# Altium schematic sheet Sheet_2.schdoc
size 424 x 302 mm
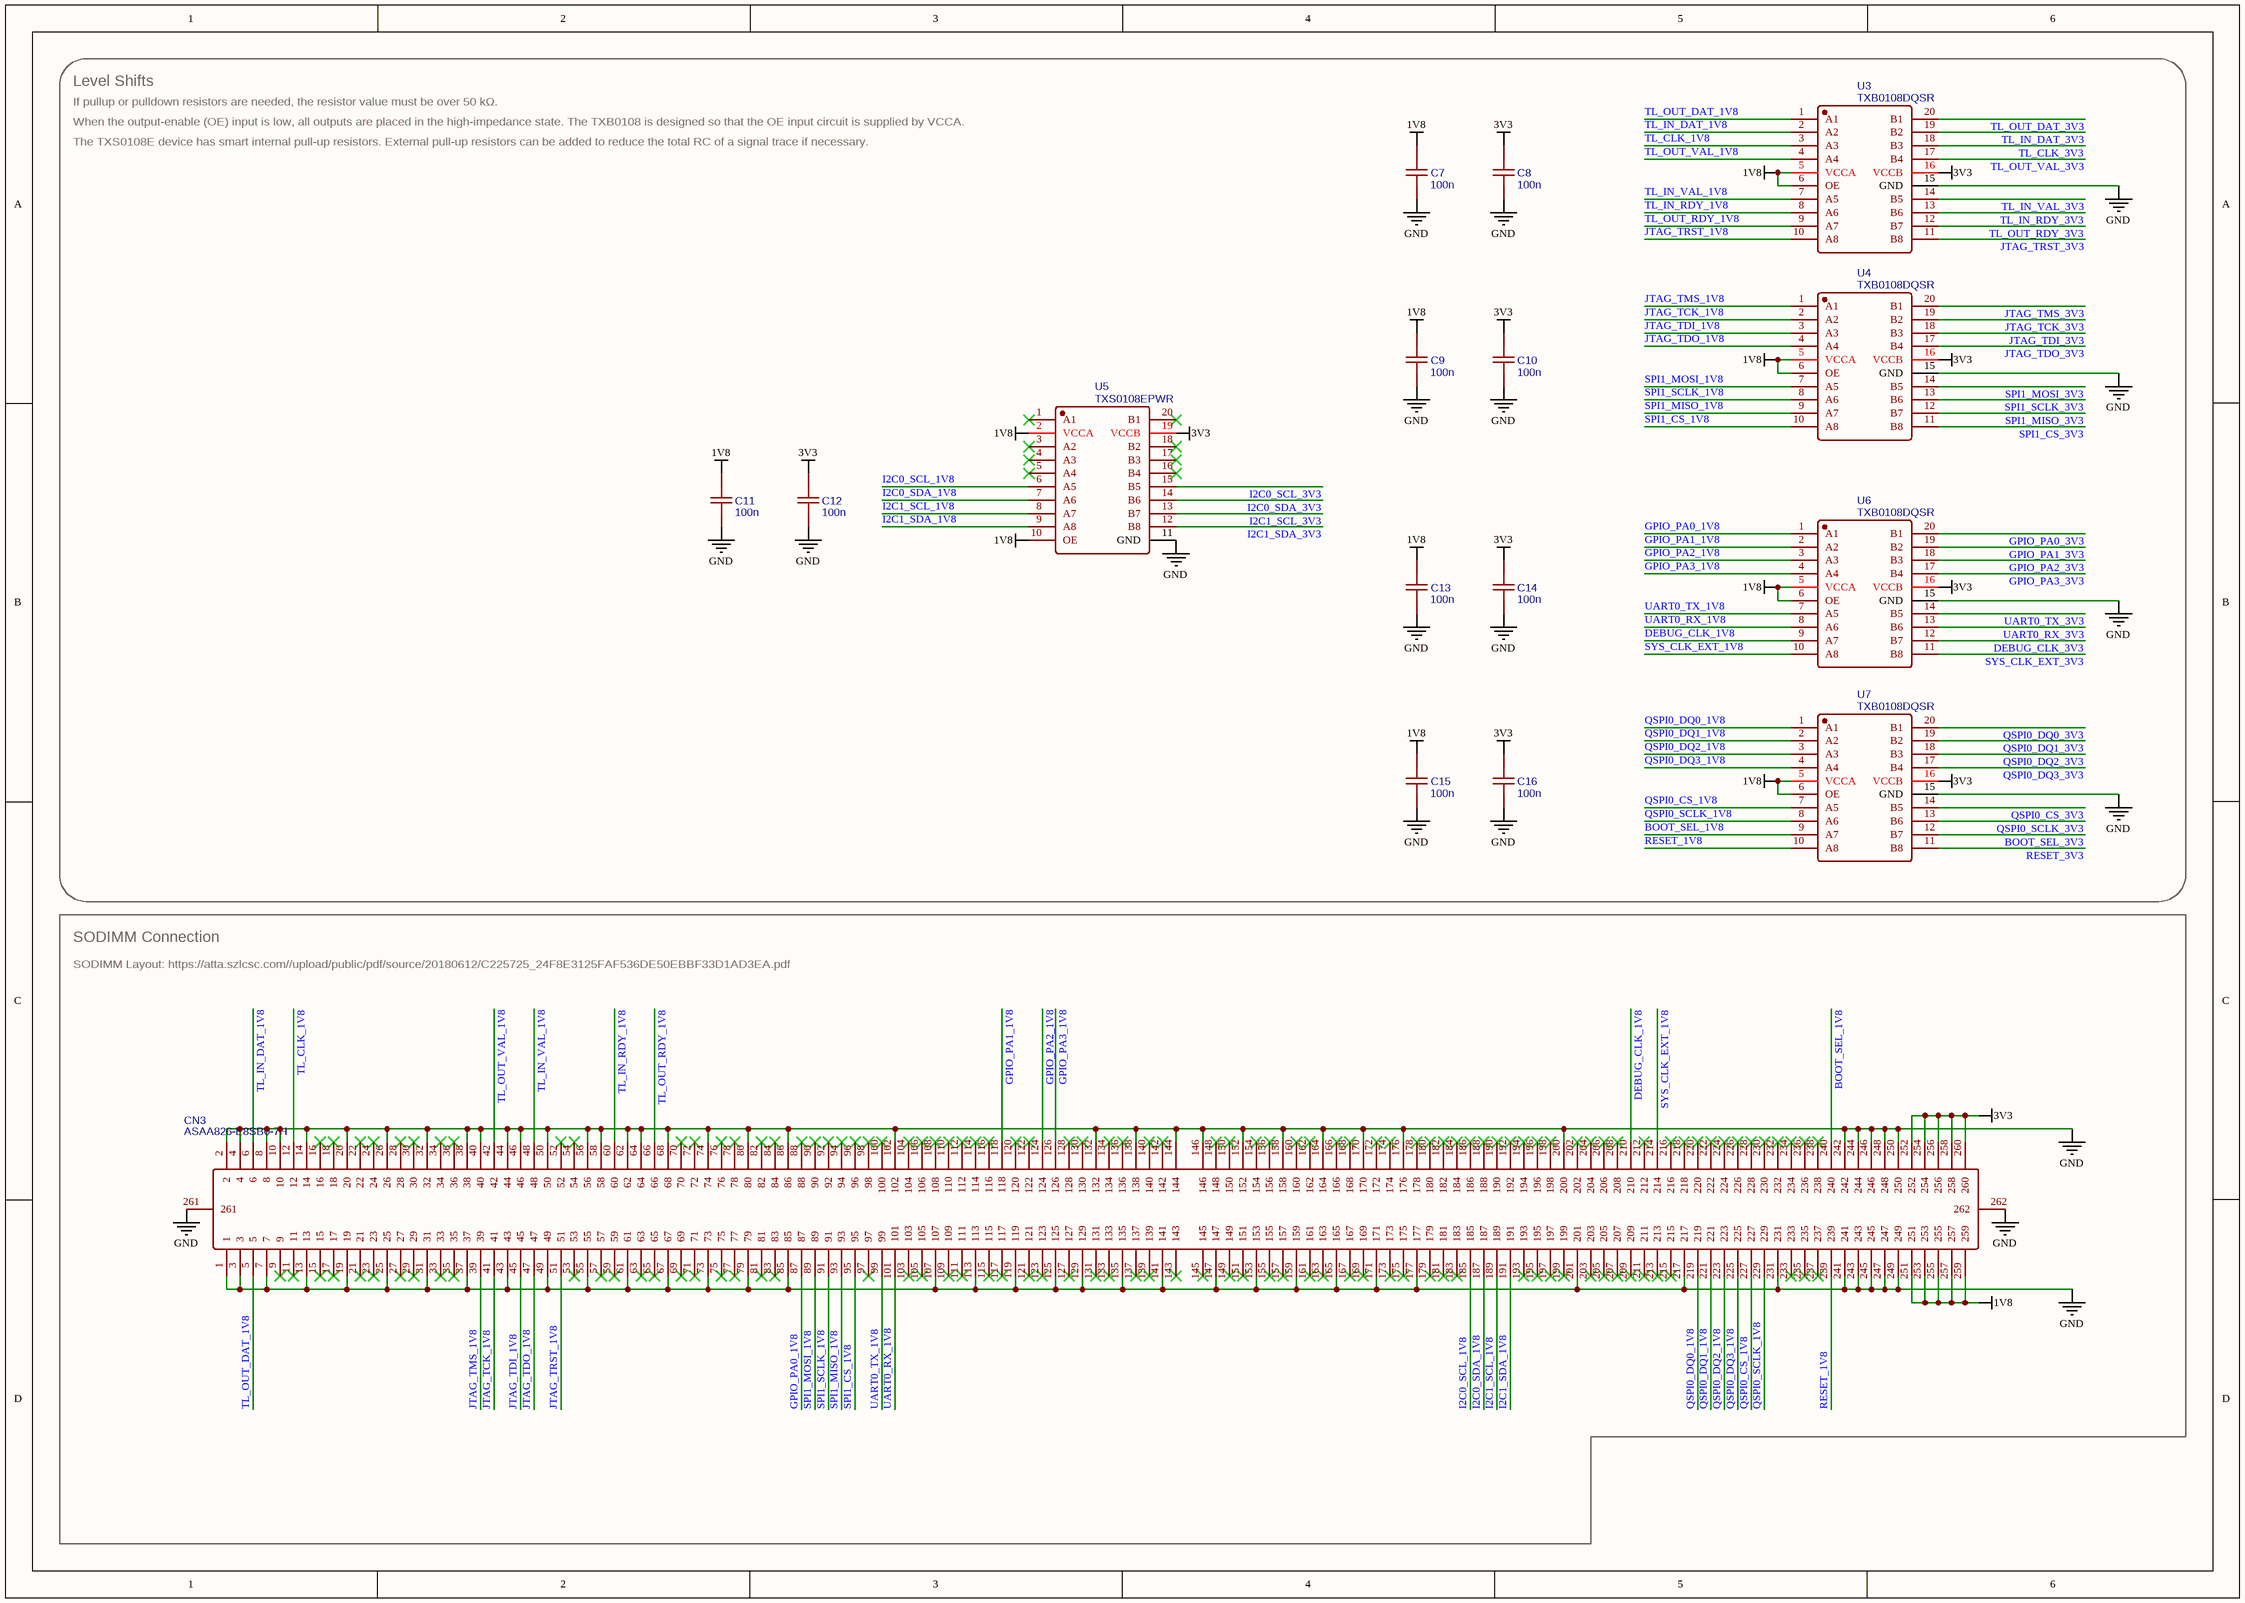
[diagram p0: Sheet_2.schdoc]

## Parts
C7  100n  [CAPA-0402]
C8  100n  [CAPA-0402]
C9  100n  [CAPA-0402]
C10  100n  [CAPA-0402]
C11  100n  [CAPA-0402]
C12  100n  [CAPA-0402]
C13  100n  [CAPA-0402]
C14  100n  [CAPA-0402]
C15  100n  [CAPA-0402]
C16  100n  [CAPA-0402]
CN3  ASAA826-E8SB0-7H  [CONN-SMD_ASAA826-E8SB0-7H]
U3  TXB0108DQSR  [SON-20_L4.0-W2.0-P0.40-BL]
U4  TXB0108DQSR  [SON-20_L4.0-W2.0-P0.40-BL]
U5  TXS0108EPWR  [TSSOP-20_L6.5-W4.4-P0.65-LS6.4-BL]
U6  TXB0108DQSR  [SON-20_L4.0-W2.0-P0.40-BL]
U7  TXB0108DQSR  [SON-20_L4.0-W2.0-P0.40-BL]

## Blocks framed on the sheet
Level Shifts: C7-C16 U3-U7
SODIMM Connection: CN3

## Nets
1V8: C7.2 C9.2 C11.2 C13.2 C15.2 CN3.251 CN3.253 CN3.255 CN3.257 CN3.259 U3.5(VCCA) U3.6(OE) U4.5(VCCA) U4.6(OE) U5.2(VCCA) U5.10(OE) U6.5(VCCA) U6.6(OE) U7.5(VCCA) U7.6(OE)
3V3: C8.2 C10.2 C12.2 C14.2 C16.2 CN3.252 CN3.254 CN3.256 CN3.258 CN3.260 U3.16(VCCB) U4.16(VCCB) U5.19(VCCB) U6.16(VCCB) U7.16(VCCB)
GND: C7.1 C8.1 C9.1 C10.1 C11.1 C12.1 C13.1 C14.1 C15.1 C16.1 CN3.1 CN3.2 CN3.3 CN3.4 CN3.7 CN3.8 CN3.10 CN3.13 CN3.14 CN3.19 CN3.20 CN3.25 CN3.26 CN3.31 CN3.32 CN3.37 CN3.38 CN3.40 CN3.43 CN3.44 CN3.46 CN3.49 CN3.50 CN3.55 CN3.56 CN3.58 CN3.61 CN3.62 CN3.64 CN3.67 CN3.68 CN3.73 CN3.74 CN3.79 CN3.80 CN3.85 CN3.86 CN3.102 CN3.107 CN3.113 CN3.119 CN3.125 CN3.129 CN3.132 CN3.135 CN3.138 CN3.141 CN3.144 CN3.146 CN3.147 CN3.152 CN3.153 CN3.158 CN3.159 CN3.164 CN3.165 CN3.170 CN3.171 CN3.176 CN3.177 CN3.200 CN3.201 CN3.217 CN3.231 CN3.241 CN3.242 CN3.243 CN3.244 CN3.245 CN3.246 CN3.247 CN3.248 CN3.249 CN3.250 CN3.261 CN3.262 U3.15(GND) U4.15(GND) U5.11(GND) U6.15(GND) U7.15(GND)
BOOT_SEL_1V8: CN3.240 U7.9(A7)
BOOT_SEL_3V3: U7.12(B7)
DEBUG_CLK_1V8: CN3.210 U6.9(A7)
DEBUG_CLK_3V3: U6.12(B7)
GPIO_PA0_1V8: CN3.87 U6.1(A1)
GPIO_PA0_3V3: U6.20(B1)
GPIO_PA1_1V8: CN3.118 U6.2(A2)
GPIO_PA1_3V3: U6.19(B2)
GPIO_PA2_1V8: CN3.124 U6.3(A3)
GPIO_PA2_3V3: U6.18(B3)
GPIO_PA3_1V8: CN3.126 U6.4(A4)
GPIO_PA3_3V3: U6.17(B4)
I2C0_SCL_1V8: CN3.185 U5.6(A5)
I2C0_SCL_3V3: U5.15(B5)
I2C0_SDA_1V8: CN3.187 U5.7(A6)
I2C0_SDA_3V3: U5.14(B6)
I2C1_SCL_1V8: CN3.189 U5.8(A7)
I2C1_SCL_3V3: U5.13(B7)
I2C1_SDA_1V8: CN3.191 U5.9(A8)
I2C1_SDA_3V3: U5.12(B8)
JTAG_TCK_1V8: CN3.41 U4.2(A2)
JTAG_TCK_3V3: U4.19(B2)
JTAG_TDI_1V8: CN3.45 U4.3(A3)
JTAG_TDI_3V3: U4.18(B3)
JTAG_TDO_1V8: CN3.47 U4.4(A4)
JTAG_TDO_3V3: U4.17(B4)
JTAG_TMS_1V8: CN3.39 U4.1(A1)
JTAG_TMS_3V3: U4.20(B1)
JTAG_TRST_1V8: CN3.51 U3.10(A8)
JTAG_TRST_3V3: U3.11(B8)
QSPI0_CS_1V8: CN3.227 U7.7(A5)
QSPI0_CS_3V3: U7.14(B5)
QSPI0_DQ0_1V8: CN3.219 U7.1(A1)
QSPI0_DQ0_3V3: U7.20(B1)
QSPI0_DQ1_1V8: CN3.221 U7.2(A2)
QSPI0_DQ1_3V3: U7.19(B2)
QSPI0_DQ2_1V8: CN3.223 U7.3(A3)
QSPI0_DQ2_3V3: U7.18(B3)
QSPI0_DQ3_1V8: CN3.225 U7.4(A4)
QSPI0_DQ3_3V3: U7.17(B4)
QSPI0_SCLK_1V8: CN3.229 U7.8(A6)
QSPI0_SCLK_3V3: U7.13(B6)
RESET_1V8: CN3.239 U7.10(A8)
RESET_3V3: U7.11(B8)
SPI1_CS_1V8: CN3.95 U4.10(A8)
SPI1_CS_3V3: U4.11(B8)
SPI1_MISO_1V8: CN3.93 U4.9(A7)
SPI1_MISO_3V3: U4.12(B7)
SPI1_MOSI_1V8: CN3.89 U4.7(A5)
SPI1_MOSI_3V3: U4.14(B5)
SPI1_SCLK_1V8: CN3.91 U4.8(A6)
SPI1_SCLK_3V3: U4.13(B6)
SYS_CLK_EXT_1V8: CN3.214 U6.10(A8)
SYS_CLK_EXT_3V3: U6.11(B8)
TL_CLK_1V8: CN3.12 U3.3(A3)
TL_CLK_3V3: U3.18(B3)
TL_IN_DAT_1V8: CN3.6 U3.2(A2)
TL_IN_DAT_3V3: U3.19(B2)
TL_IN_RDY_1V8: CN3.60 U3.8(A6)
TL_IN_RDY_3V3: U3.13(B6)
TL_IN_VAL_1V8: CN3.48 U3.7(A5)
TL_IN_VAL_3V3: U3.14(B5)
TL_OUT_DAT_1V8: CN3.5 U3.1(A1)
TL_OUT_DAT_3V3: U3.20(B1)
TL_OUT_RDY_1V8: CN3.66 U3.9(A7)
TL_OUT_RDY_3V3: U3.12(B7)
TL_OUT_VAL_1V8: CN3.42 U3.4(A4)
TL_OUT_VAL_3V3: U3.17(B4)
UART0_RX_1V8: CN3.101 U6.8(A6)
UART0_RX_3V3: U6.13(B6)
UART0_TX_1V8: CN3.99 U6.7(A5)
UART0_TX_3V3: U6.14(B5)

Not connected (* = marked no-connect by the designer): CN3 9* 11* 15* 16* 17* 18* 21* 22* 23* 24* 27* 28* 29* 30* 33* 34* 35* 36* 52* 53* 54* 57* 59* 63* 65* 69* 70* 71* 72* 75* 76* 77* 78* 81* 82* 83* 84* 88* 90* 92* 94* 96* 97* 98* 100* 103* 104* 105* 106* 108* 109* 110* 111* 112* 114* 115* 116* 117* 120* 121* 122* 123* 127* 128* 130* 131* 133* 134* 136* 137* 139* 140* 142* 143* 145* 148* 149* 150* 151* 154* 155* 156* 157* 160* 161* 162* 163* 166* 167* 168* 169* 172* 173* 174* 175* 178* 179* 180* 181* 182* 183* 184* 186* 188* 190* 192* 193* 194* 195* 196* 197* 198* 199* 202* 203* 204* 205* 206* 207* 208* 209* 211* 212* 213* 215* 216* 218* 220* 222* 224* 226* 228* 230* 232* 233* 234* 235* 236* 237* 238*; U5 1(A1)* 3(A2)* 4(A3)* 5(A4)* 16(B4)* 17(B3)* 18(B2)* 20(B1)*

## Notes on the sheet
- If pullup or pulldown resistors are needed, the resistor value must be over 50 kΩ.
- When the output-enable (OE) input is low, all outputs are placed in the high-impedance state. The TXB0108 is designed so that the OE input circuit is supplied by VCCA.
- The TXS0108E device has smart internal pull-up resistors. External pull-up resistors can be added to reduce the total RC of a signal trace if necessary.
- SODIMM Layout: https://atta.szlcsc.com//upload/public/pdf/source/20180612/C225725_24F8E3125FAF536DE50EBBF33D1AD3EA.pdf

## Library data of the parts
C7-C16 = 100n: BOM_Manufacturer Part: CL05B104KB54PNC; BOM_Manufacturer: SAMSUNG; nameAlias: Value(F); BOM_Supplier Part: C307331; BOM_Supplier: LCSC; link: https://atta.szlcsc.com//upload/public/pdf/source/20160103/1457707735223.pdf; spicePre: C; spiceSymbolName: CAPA-0402_100n
CN3 = ASAA826-E8SB0-7H: BOM_Manufacturer: FOXCONN(富士康); BOM_Supplier: LCSC; BOM_Supplier Part: C2761395; BOM_Manufacturer Part: ASAA826-E8SB0-7H; BOM_JLCPCB Part Class: Extended Part; link: https://atta.szlcsc.com//upload/public/pdf/source/20210319/C2761395_2653904C6C1B88C6A2301D38F64E271B.pdf; spicePre: C; spiceSymbolName: ASAA826-E8SB0-7H
U3 U4 U6 U7 = TXB0108DQSR: BOM_Manufacturer: TI; BOM_Supplier: LCSC; BOM_Manufacturer Part: TXB0108DQSR; BOM_Supplier Part: C427057; BOM_JLCPCB Part Class: Extended Part; link: https://www.ti.com/lit/ds/symlink/txb0108.pdf?HQS=dis-mous-null-mousermode-dsf-pf-null-wwe; spicePre: U; spiceSymbolName: TXB0108DQSR
U5 = TXS0108EPWR: BOM_Manufacturer: TI; BOM_Supplier: LCSC; BOM_Manufacturer Part: TXS0108EPWR; BOM_Supplier Part: C17206; BOM_JLCPCB Part Class: Extended Part; link: https://www.ti.com/lit/ds/symlink/txs0108e.pdf; spicePre: U; spiceSymbolName: TXS0108EPWR